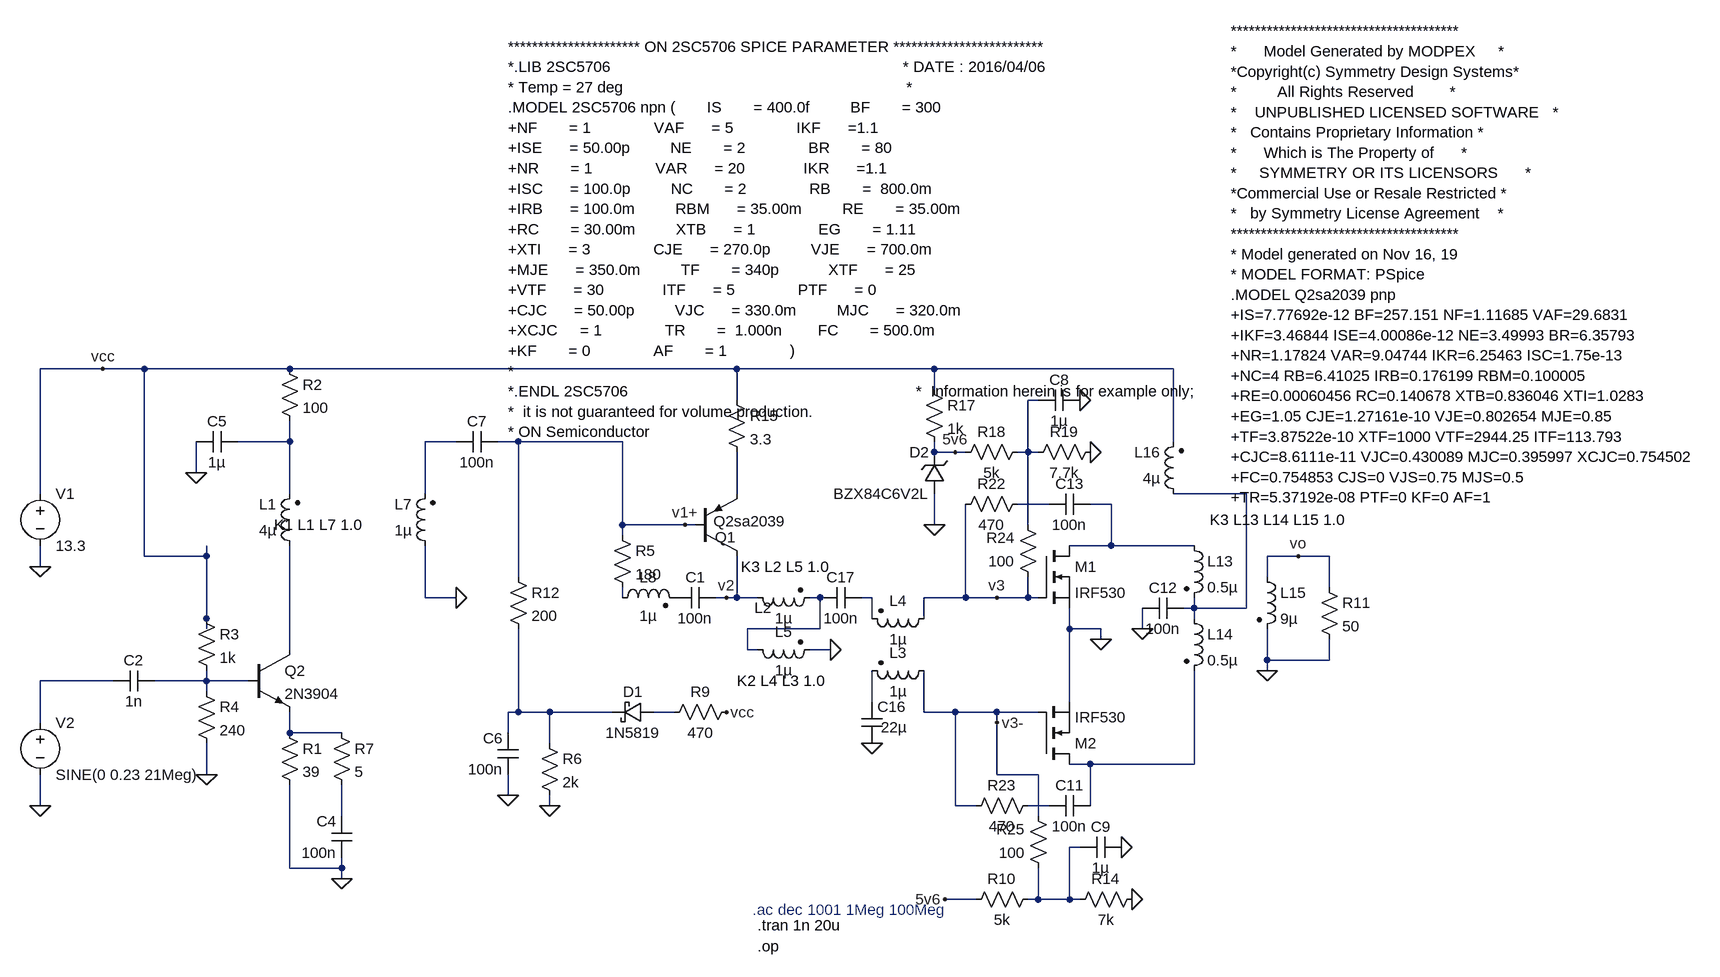
[diagram p0: schematic amp4.asc]
amp4.asc, the LTspice schematic file:
Version 4
SHEET 1 2916 1104
WIRE -48 16 -144 16
WIRE 16 16 -48 16
WIRE 240 16 16 16
WIRE 928 16 240 16
WIRE 1232 16 928 16
WIRE 1600 16 1232 16
WIRE 1232 48 1232 16
WIRE 928 64 928 16
WIRE 1392 64 1376 64
WIRE 240 128 240 96
WIRE 240 128 160 128
WIRE 496 128 448 128
WIRE 592 128 560 128
WIRE 752 128 592 128
WIRE 1600 128 1600 16
WIRE 1232 144 1232 128
WIRE 1264 144 1232 144
WIRE 1280 144 1264 144
WIRE 1376 144 1376 64
WIRE 1376 144 1360 144
WIRE 1392 144 1376 144
WIRE 96 176 96 128
WIRE -144 208 -144 16
WIRE 240 208 240 128
WIRE 448 208 448 128
WIRE 928 208 928 144
WIRE 1712 208 1600 208
WIRE 1408 224 1360 224
WIRE 1504 224 1472 224
WIRE 752 256 752 128
WIRE 848 256 752 256
WIRE 864 256 848 256
WIRE 1232 256 1232 208
WIRE 1376 256 1376 144
WIRE 752 272 752 256
WIRE 1504 288 1504 224
WIRE 1504 288 1440 288
WIRE 1632 288 1504 288
WIRE 16 304 16 16
WIRE 112 304 112 288
WIRE 112 304 16 304
WIRE 1792 304 1744 304
WIRE 1840 304 1792 304
WIRE -144 320 -144 288
WIRE 592 336 592 128
WIRE 1744 336 1744 304
WIRE 1840 352 1840 304
WIRE 448 368 448 288
WIRE 496 368 448 368
WIRE 752 368 752 352
WIRE 912 368 896 368
WIRE 928 368 928 304
WIRE 928 368 912 368
WIRE 960 368 928 368
WIRE 1056 368 1040 368
WIRE 1136 368 1120 368
WIRE 1280 368 1280 224
WIRE 1280 368 1216 368
WIRE 1328 368 1280 368
WIRE 1376 368 1376 336
WIRE 1376 368 1328 368
WIRE 1392 368 1376 368
WIRE 1632 384 1632 368
WIRE 1632 384 1616 384
WIRE 1712 384 1712 208
WIRE 1712 384 1632 384
WIRE 112 400 112 304
WIRE 1136 400 1136 368
WIRE 1216 400 1216 368
WIRE 1632 400 1632 384
WIRE 112 416 112 400
WIRE 1056 416 1056 368
WIRE 1056 416 944 416
WIRE 1440 416 1440 384
WIRE 1488 416 1440 416
WIRE 1552 416 1552 384
WIRE 1488 432 1488 416
WIRE 240 448 240 288
WIRE 944 448 944 416
WIRE 960 448 944 448
WIRE 1072 448 1040 448
WIRE 1744 464 1744 416
WIRE 1840 464 1840 432
WIRE 1840 464 1744 464
WIRE 1744 480 1744 464
WIRE -32 496 -144 496
WIRE 112 496 112 480
WIRE 112 496 32 496
WIRE 176 496 112 496
WIRE 112 512 112 496
WIRE 1136 528 1136 480
WIRE 1440 528 1440 416
WIRE 592 544 592 416
WIRE 592 544 576 544
WIRE 640 544 592 544
WIRE 736 544 640 544
WIRE 832 544 800 544
WIRE 1216 544 1216 480
WIRE 1264 544 1216 544
WIRE 1328 544 1264 544
WIRE 1392 544 1328 544
WIRE -144 560 -144 496
WIRE 1328 560 1328 544
WIRE 240 576 240 544
WIRE 320 576 240 576
WIRE 576 576 576 544
WIRE 640 592 640 544
WIRE 1472 624 1440 624
WIRE 1632 624 1632 480
WIRE 1632 624 1472 624
WIRE 112 640 112 592
WIRE 1328 640 1328 560
WIRE 1392 640 1328 640
WIRE 576 672 576 640
WIRE -144 688 -144 640
WIRE 640 688 640 672
WIRE 1264 688 1264 544
WIRE 1296 688 1264 688
WIRE 1408 688 1376 688
WIRE 1472 688 1472 624
WIRE 320 704 320 656
WIRE 1392 704 1392 640
WIRE 1456 752 1440 752
WIRE 240 784 240 656
WIRE 320 784 320 768
WIRE 320 784 240 784
WIRE 320 800 320 784
WIRE 1296 832 1248 832
WIRE 1392 832 1392 784
WIRE 1392 832 1376 832
WIRE 1440 832 1440 752
WIRE 1440 832 1392 832
WIRE 1456 832 1440 832
FLAG 320 800 0
FLAG 112 640 0
FLAG 96 176 0
FLAG -48 16 vcc
FLAG -144 688 0
FLAG -144 320 0
FLAG 640 688 0
FLAG 576 672 0
FLAG 848 256 v1+
FLAG 496 368 0
FLAG 1136 592 0
FLAG 1488 432 0
FLAG 1552 416 0
FLAG 1744 480 0
FLAG 1232 256 0
FLAG 1472 144 0
FLAG 912 368 v2
FLAG 1792 304 vo
FLAG 1328 368 v3
FLAG 1456 64 0
FLAG 1264 144 5v6
FLAG 1536 832 0
FLAG 1520 752 0
FLAG 1248 832 5v6
FLAG 1072 448 0
FLAG 1328 560 v3-
FLAG 912 544 vcc
DATAFLAG 848 16 "$"
DATAFLAG 160 496 "$"
DATAFLAG 288 576 "$"
DATAFLAG 176 128 "$"
DATAFLAG 672 128 "$"
DATAFLAG 1376 144 "$"
DATAFLAG 1552 624 "$"
DATAFLAG 1440 832 "$"
SYMBOL npn 176 448 R0
SYMATTR InstName Q2
SYMATTR Value 2N3904
SYMBOL voltage -144 192 R0
SYMATTR InstName V1
SYMATTR Value 13.3
SYMBOL voltage -144 544 R0
SYMATTR InstName V2
SYMATTR Value SINE(0 0.23 21Meg)
SYMATTR Value2 AC 1
SYMATTR SpiceLine Rser=50
SYMBOL cap 32 480 R90
WINDOW 0 0 32 VBottom 2
WINDOW 3 32 32 VTop 2
SYMATTR InstName C2
SYMATTR Value 1n
SYMBOL ind2 256 304 R180
WINDOW 0 36 80 Left 2
WINDOW 3 36 40 Left 2
SYMATTR InstName L1
SYMATTR Value 4µ
SYMATTR Type ind
SYMBOL res 224 560 R0
SYMATTR InstName R1
SYMATTR Value 39
SYMBOL res 224 0 R0
SYMATTR InstName R2
SYMATTR Value 100
SYMBOL res 96 384 R0
SYMATTR InstName R3
SYMATTR Value 1k
SYMBOL res 96 496 R0
SYMATTR InstName R4
SYMATTR Value 240
SYMBOL cap 336 768 R180
WINDOW 0 24 56 Left 2
WINDOW 3 24 8 Left 2
SYMATTR InstName C4
SYMATTR Value 100n
SYMBOL res 304 560 R0
SYMATTR InstName R7
SYMATTR Value 5
SYMBOL cap 160 112 R90
WINDOW 0 0 32 VBottom 2
WINDOW 3 32 32 VTop 2
SYMATTR InstName C5
SYMATTR Value 1µ
SYMBOL ind2 1232 464 R90
WINDOW 0 4 56 VBottom 2
WINDOW 3 32 56 VTop 2
SYMATTR InstName L3
SYMATTR Value 1µ
SYMATTR Type ind
SYMBOL ind2 1232 384 R90
WINDOW 0 4 56 VBottom 2
WINDOW 3 32 56 VTop 2
SYMATTR InstName L4
SYMATTR Value 1µ
SYMATTR Type ind
SYMBOL ind2 944 352 M90
WINDOW 0 47 25 VBottom 2
WINDOW 3 32 56 VTop 2
SYMATTR InstName L2
SYMATTR Value 1µ
SYMATTR Type ind
SYMBOL ind2 944 432 M90
WINDOW 0 4 56 VBottom 2
WINDOW 3 32 56 VTop 2
SYMATTR InstName L5
SYMATTR Value 1µ
SYMATTR Type ind
SYMATTR SpiceLine Rser=1m
SYMBOL schottky 800 528 R90
WINDOW 0 0 32 VBottom 2
WINDOW 3 32 32 VTop 2
SYMATTR InstName D1
SYMATTR Value 1N5819
SYMATTR Description Diode
SYMATTR Type diode
SYMBOL res 624 576 R0
SYMATTR InstName R6
SYMATTR Value 2k
SYMBOL cap 592 640 R180
WINDOW 0 24 56 Left 2
WINDOW 3 24 8 Left 2
SYMATTR InstName C6
SYMATTR Value 100n
SYMBOL pnp 864 304 M180
WINDOW 0 30 29 Left 2
WINDOW 3 28 54 Left 2
SYMATTR InstName Q1
SYMATTR Value Q2sa2039
SYMBOL ind2 736 384 R270
WINDOW 0 32 56 VTop 2
WINDOW 3 4 56 VBottom 2
SYMATTR InstName L8
SYMATTR Value 1µ
SYMATTR Type ind
SYMBOL res 736 256 R0
SYMATTR InstName R5
SYMATTR Value 180
SYMBOL res 928 528 R90
WINDOW 0 0 56 VBottom 2
WINDOW 3 32 56 VTop 2
SYMATTR InstName R9
SYMATTR Value 470
SYMBOL ind2 464 304 R180
WINDOW 0 36 80 Left 2
WINDOW 3 36 40 Left 2
SYMATTR InstName L7
SYMATTR Value 1µ
SYMATTR Type ind
SYMBOL cap 496 144 R270
WINDOW 0 32 32 VTop 2
WINDOW 3 0 32 VBottom 2
SYMATTR InstName C7
SYMATTR Value 100n
SYMBOL res 576 320 R0
SYMATTR InstName R12
SYMATTR Value 200
SYMBOL res 912 48 R0
SYMATTR InstName R15
SYMATTR Value 3.3
SYMBOL nmos 1392 288 R0
SYMATTR InstName M1
SYMATTR Value IRF530
SYMBOL ind2 1616 272 R0
SYMATTR InstName L13
SYMATTR Value 0.5µ
SYMATTR Type ind
SYMBOL ind2 1616 384 R0
SYMATTR InstName L14
SYMATTR Value 0.5µ
SYMATTR Type ind
SYMBOL ind2 1728 320 R0
SYMATTR InstName L15
SYMATTR Value 9µ
SYMATTR Type ind
SYMBOL cap 1552 400 R270
WINDOW 0 32 32 VTop 2
WINDOW 3 0 32 VBottom 2
SYMATTR InstName C12
SYMATTR Value 100n
SYMBOL res 1824 336 R0
SYMATTR InstName R11
SYMATTR Value 50
SYMBOL ind2 1616 224 R180
WINDOW 0 36 80 Left 2
WINDOW 3 36 40 Left 2
SYMATTR InstName L16
SYMATTR Value 4µ
SYMATTR Type ind
SYMBOL zener 1248 208 R180
WINDOW 0 24 64 Left 2
WINDOW 3 24 0 Left 2
SYMATTR InstName D2
SYMATTR Value BZX84C6V2L
SYMBOL res 1216 32 R0
SYMATTR InstName R17
SYMATTR Value 1k
SYMBOL res 1376 128 R90
WINDOW 0 0 56 VBottom 2
WINDOW 3 32 56 VTop 2
SYMATTR InstName R18
SYMATTR Value 5k
SYMBOL res 1488 128 R90
WINDOW 0 0 56 VBottom 2
WINDOW 3 32 56 VTop 2
SYMATTR InstName R19
SYMATTR Value 7.7k
SYMBOL cap 1408 240 R270
WINDOW 0 32 32 VTop 2
WINDOW 3 0 32 VBottom 2
SYMATTR InstName C13
SYMATTR Value 100n
SYMBOL nmos 1392 624 M180
SYMATTR InstName M2
SYMATTR Value IRF530
SYMBOL cap 1408 704 R270
WINDOW 0 32 32 VTop 2
WINDOW 3 0 32 VBottom 2
SYMATTR InstName C11
SYMATTR Value 100n
SYMBOL res 1376 208 R90
WINDOW 0 0 56 VBottom 2
WINDOW 3 32 56 VTop 2
SYMATTR InstName R22
SYMATTR Value 470
SYMBOL res 1392 672 R90
WINDOW 0 0 56 VBottom 2
WINDOW 3 32 56 VTop 2
SYMATTR InstName R23
SYMATTR Value 470
SYMBOL cap 1392 80 R270
WINDOW 0 32 32 VTop 2
WINDOW 3 0 32 VBottom 2
SYMATTR InstName C8
SYMATTR Value 1µ
SYMBOL res 1392 816 R90
WINDOW 0 0 56 VBottom 2
WINDOW 3 32 56 VTop 2
SYMATTR InstName R10
SYMATTR Value 5k
SYMBOL res 1552 816 R90
WINDOW 0 0 56 VBottom 2
WINDOW 3 32 56 VTop 2
SYMATTR InstName R14
SYMATTR Value 7k
SYMBOL cap 1456 768 R270
WINDOW 0 32 32 VTop 2
WINDOW 3 0 32 VBottom 2
SYMATTR InstName C9
SYMATTR Value 1µ
SYMBOL res 1392 352 R180
WINDOW 0 36 76 Left 2
WINDOW 3 36 40 Left 2
SYMATTR InstName R24
SYMATTR Value 100
SYMBOL res 1408 800 R180
WINDOW 0 36 76 Left 2
WINDOW 3 36 40 Left 2
SYMATTR InstName R25
SYMATTR Value 100
SYMBOL cap 1120 528 R0
WINDOW 3 30 39 Left 2
SYMATTR InstName C16
SYMATTR Value 22µ
SYMBOL cap 1056 384 R270
WINDOW 0 32 32 VTop 2
WINDOW 3 0 32 VBottom 2
SYMATTR InstName C17
SYMATTR Value 100n
SYMBOL cap 896 352 R90
WINDOW 0 0 32 VBottom 2
WINDOW 3 32 32 VTop 2
SYMATTR InstName C1
SYMATTR Value 100n
TEXT 952 848 Left 2 ;.ac dec 1001 1Meg 100Meg
TEXT 960 872 Left 2 !.tran 1n 20u
TEXT 928 496 Left 2 !K2 L4 L3 1.0
TEXT 576 -480 Left 2 !********************** ON 2SC5706 SPICE PARAMETER *************************\n*.LIB 2SC5706                                                                 * DATE : 2016/04/06                                                           \n* Temp = 27 deg                                                               *                                                                             \n.MODEL 2SC5706 npn (       IS       = 400.0f         BF       = 300           \n+NF       = 1              VAF      = 5              IKF      =1.1            \n+ISE      = 50.00p         NE       = 2              BR       = 80            \n+NR       = 1              VAR      = 20             IKR      =1.1            \n+ISC      = 100.0p         NC       = 2              RB       =  800.0m       \n+IRB      = 100.0m         RBM      = 35.00m         RE       = 35.00m        \n+RC       = 30.00m         XTB      = 1              EG       = 1.11          \n+XTI      = 3              CJE      = 270.0p         VJE      = 700.0m        \n+MJE      = 350.0m         TF       = 340p           XTF      = 25            \n+VTF      = 30             ITF      = 5              PTF      = 0             \n+CJC      = 50.00p         VJC      = 330.0m         MJC      = 320.0m        \n+XCJC     = 1              TR       =  1.000n        FC       = 500.0m        \n+KF       = 0              AF       = 1              )                        \n*                                                                             \n*.ENDL 2SC5706                                                                *  Information herein is for example only;                                    \n*  it is not guaranteed for volume production.                                \n* ON Semiconductor
TEXT 216 256 Left 2 !K1 L1 L7 1.0
TEXT 1688 -504 Left 2 !**************************************\n*      Model Generated by MODPEX     *\n*Copyright(c) Symmetry Design Systems*\n*         All Rights Reserved        *\n*    UNPUBLISHED LICENSED SOFTWARE   *\n*   Contains Proprietary Information *\n*      Which is The Property of      *\n*     SYMMETRY OR ITS LICENSORS      *\n*Commercial Use or Resale Restricted *\n*   by Symmetry License Agreement    *\n**************************************\n* Model generated on Nov 16, 19\n* MODEL FORMAT: PSpice\n.MODEL Q2sa2039 pnp\n+IS=7.77692e-12 BF=257.151 NF=1.11685 VAF=29.6831\n+IKF=3.46844 ISE=4.00086e-12 NE=3.49993 BR=6.35793\n+NR=1.17824 VAR=9.04744 IKR=6.25463 ISC=1.75e-13\n+NC=4 RB=6.41025 IRB=0.176199 RBM=0.100005\n+RE=0.00060456 RC=0.140678 XTB=0.836046 XTI=1.0283\n+EG=1.05 CJE=1.27161e-10 VJE=0.802654 MJE=0.85\n+TF=3.87522e-10 XTF=1000 VTF=2944.25 ITF=113.793\n+CJC=8.6111e-11 VJC=0.430089 MJC=0.395997 XCJC=0.754502\n+FC=0.754853 CJS=0 VJS=0.75 MJS=0.5\n+TR=5.37192e-08 PTF=0 KF=0 AF=1
TEXT 960 904 Left 2 !.op
TEXT 1072 320 Right 2 !K3 L2 L5 1.0
TEXT 1656 248 Left 2 !K3 L13 L14 L15 1.0

The netlist it stands for:
* amp4.asc
Q2 N011 N013 N017 0 2N3904
V1 vcc 0 13.3
V2 N012 0 SINE(0 0.23 21Meg) AC 1 Rser=50
C2 N013 N012 1n
L1 N011 N002 4µ
R1 N017 0 39
R2 vcc N002 100
R3 vcc N013 1k
R4 N013 0 240
C4 0 N020 100n
R7 N017 N020 5
C5 N002 0 1µ
L3 v3- N014 1µ
L4 v3 N010 1µ
L2 v2 N009 1µ
L5 N009 0 1µ Rser=1m
D1 N016 N015 1N5819
R6 N015 0 2k
C6 0 N015 100n
Q1 v2 v1+ N004 0 Q2sa2039
L8 N008 P001 1µ
R5 v1+ N008 180
R9 vcc N016 470
L7 0 N003 1µ
C7 N003 v1+ 100n
R12 v1+ N015 200
R15 vcc N004 3.3
M1 N007 v3 0 0 IRF530
L13 N007 N005 0.5µ
L14 N005 N018 0.5µ
L15 vo 0 9µ
C12 0 N005 100n
R11 vo 0 50
L16 N005 vcc 4µ
D2 0 5v6 BZX84C6V2L
R17 vcc 5v6 1k
R18 N001 5v6 5k
R19 0 N001 7.7k
C13 N006 N007 100n
M2 N018 v3- 0 0 IRF530
C11 N019 N018 100n
R22 N006 v3 470
R23 N019 v3- 470
C8 N001 0 1µ
R10 N021 5v6 5k
R14 0 N021 7k
C9 N021 0 1µ
R24 v3 N001 100
R25 N021 v3- 100
C16 N014 0 22µ
C17 N009 N010 100n
C1 v2 P001 100n
.model D D
.lib standard.dio
.model NPN NPN
.model PNP PNP
.lib standard.bjt
.model NMOS NMOS
.model PMOS PMOS
.lib standard.mos
* .ac dec 1001 1Meg 100Meg
.tran 1n 20u
K2 L4 L3 1.0
********************** ON 2SC5706 SPICE PARAMETER *************************
*.LIB 2SC5706                                                                 * DATE : 2016/04/06
* Temp = 27 deg                                                               *
.MODEL 2SC5706 npn (       IS       = 400.0f         BF       = 300
+NF       = 1              VAF      = 5              IKF      =1.1
+ISE      = 50.00p         NE       = 2              BR       = 80
+NR       = 1              VAR      = 20             IKR      =1.1
+ISC      = 100.0p         NC       = 2              RB       =  800.0m
+IRB      = 100.0m         RBM      = 35.00m         RE       = 35.00m
+RC       = 30.00m         XTB      = 1              EG       = 1.11
+XTI      = 3              CJE      = 270.0p         VJE      = 700.0m
+MJE      = 350.0m         TF       = 340p           XTF      = 25
+VTF      = 30             ITF      = 5              PTF      = 0
+CJC      = 50.00p         VJC      = 330.0m         MJC      = 320.0m
+XCJC     = 1              TR       =  1.000n        FC       = 500.0m
+KF       = 0              AF       = 1              )
*
*.ENDL 2SC5706                                                                *  Information herein is for example only;
*  it is not guaranteed for volume production.
* ON Semiconductor
K1 L1 L7 1.0
**************************************
*      Model Generated by MODPEX     *
*Copyright(c) Symmetry Design Systems*
*         All Rights Reserved        *
*    UNPUBLISHED LICENSED SOFTWARE   *
*   Contains Proprietary Information *
*      Which is The Property of      *
*     SYMMETRY OR ITS LICENSORS      *
*Commercial Use or Resale Restricted *
*   by Symmetry License Agreement    *
**************************************
* Model generated on Nov 16, 19
* MODEL FORMAT: PSpice
.MODEL Q2sa2039 pnp
+IS=7.77692e-12 BF=257.151 NF=1.11685 VAF=29.6831
+IKF=3.46844 ISE=4.00086e-12 NE=3.49993 BR=6.35793
+NR=1.17824 VAR=9.04744 IKR=6.25463 ISC=1.75e-13
+NC=4 RB=6.41025 IRB=0.176199 RBM=0.100005
+RE=0.00060456 RC=0.140678 XTB=0.836046 XTI=1.0283
+EG=1.05 CJE=1.27161e-10 VJE=0.802654 MJE=0.85
+TF=3.87522e-10 XTF=1000 VTF=2944.25 ITF=113.793
+CJC=8.6111e-11 VJC=0.430089 MJC=0.395997 XCJC=0.754502
+FC=0.754853 CJS=0 VJS=0.75 MJS=0.5
+TR=5.37192e-08 PTF=0 KF=0 AF=1
.op
K3 L2 L5 1.0
K3 L13 L14 L15 1.0
.backanno
.end